# EAGLE design youuuuuuh (EAGLE 9.6.2)
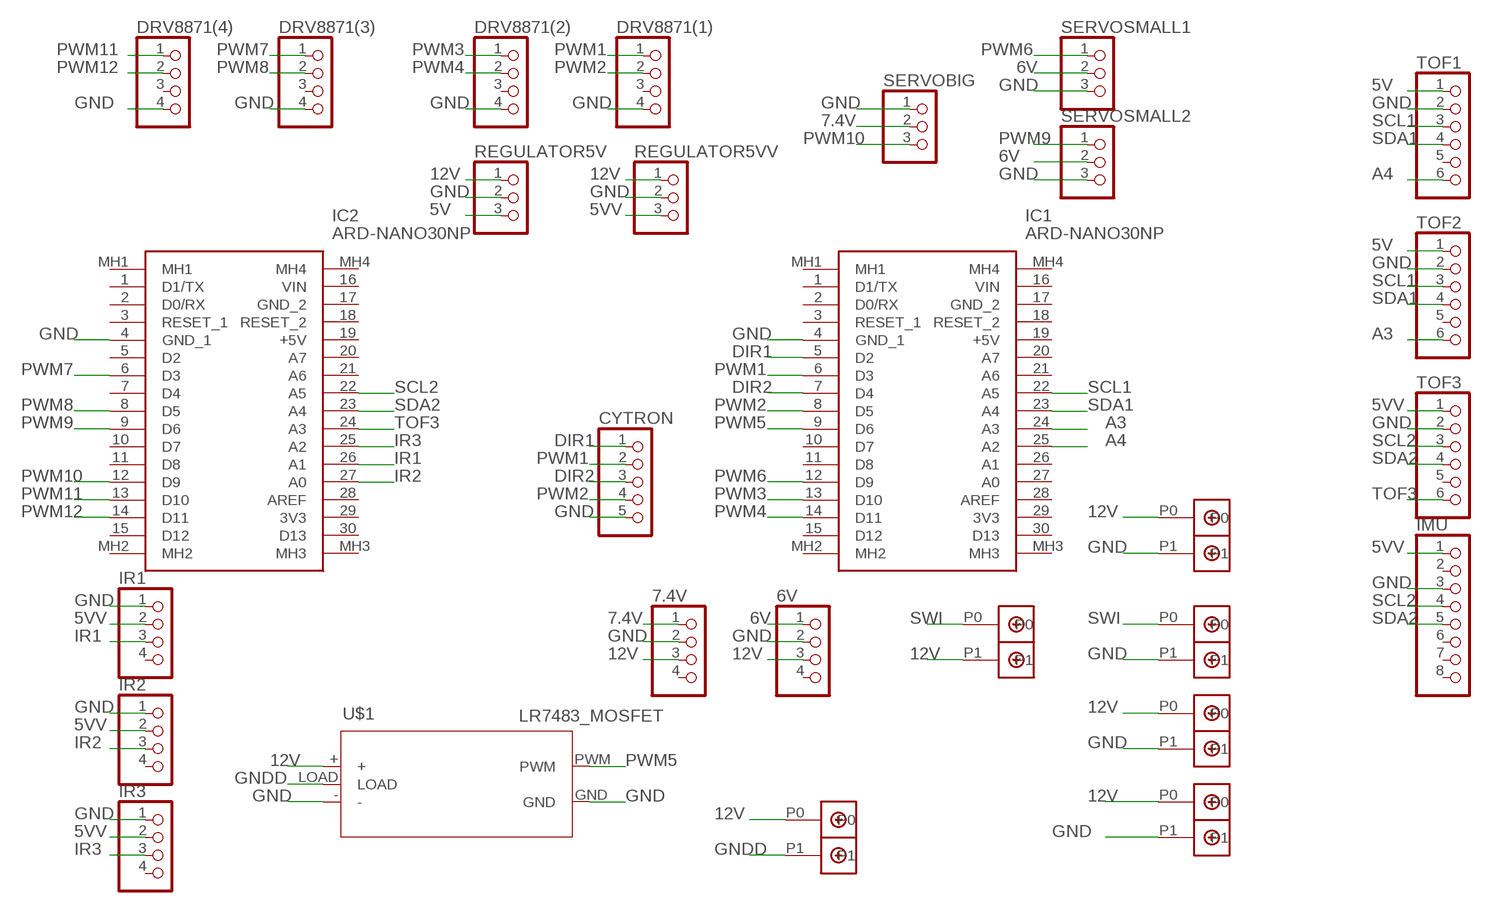
[diagram p0: schematic, sheet 1]

## Parts
6V  PINHD-1X4  [1X04]
7.4V  PINHD-1X4  [1X04]
BATERY  DBCONN-1X2  [DBCONN-1X2]
BUCKSERVO  DBCONN-1X2  [DBCONN-1X2]
CYTRON  PINHD-1X5  [1X05]
CYTRONPOWER  DBCONN-1X2  [DBCONN-1X2]
DRV8871(1)  PINHD-1X4  [1X04]
DRV8871(2)  PINHD-1X4  [1X04]
DRV8871(3)  PINHD-1X4  [1X04]
DRV8871(4)  PINHD-1X4  [1X04]
IC1  ARD-NANO30NP  [ARDNANO30NP]
IC2  ARD-NANO30NP  [ARDNANO30NP]
IMU  PINHD-1X8  [1X08]
IR1  PINHD-1X4  [1X04]
IR2  PINHD-1X4  [1X04]
IR3  PINHD-1X4  [1X04]
LEDS1  DBCONN-1X2  [DBCONN-1X2]
LEDS2  DBCONN-1X2  [DBCONN-1X2]
LEDS3  DBCONN-1X2  [DBCONN-1X2]
REGULATOR5V  PINHD-1X3  [1X03]
REGULATOR5VV  PINHD-1X3  [1X03]
SERVOBIG  PINHD-1X3  [1X03]
SERVOSMALL1  PINHD-1X3  [1X03]
SERVOSMALL2  PINHD-1X3  [1X03]
TOF1  PINHD-1X6  [1X06]
TOF2  PINHD-1X6  [1X06]
TOF3  PINHD-1X6  [1X06]
U$1  LR7483_MOSFET  [LR7483_MOSFET]

## Nets
5V: REGULATOR5V.3 TOF1.1 TOF2.1
5VV: IMU.1 IR1.2 IR2.2 IR3.2 REGULATOR5VV.3 TOF3.1
6V: 6V.1 SERVOSMALL1.2 SERVOSMALL2.2
7.4V: 7.4V.1 SERVOBIG.2
12V: 6V.3 7.4V.3 BUCKSERVO.P0 CYTRONPOWER.P0 LEDS1.P1 LEDS2.P0 LEDS3.P0 REGULATOR5V.1 REGULATOR5VV.1 U$1.+
A3: IC1.24(A3) TOF2.6
A4: IC1.25(A2) TOF1.6
DIR1: CYTRON.1 IC1.5(D2)
DIR2: CYTRON.3 IC1.7(D4)
GND: 6V.2 7.4V.2 BATERY.P1 BUCKSERVO.P1 CYTRON.5 CYTRONPOWER.P1 DRV8871(1).4 DRV8871(2).4 DRV8871(3).4 DRV8871(4).4 IC1.4(GND_1) IC2.4(GND_1) IMU.3 IR1.1 IR2.1 IR3.1 LEDS2.P1 REGULATOR5V.2 REGULATOR5VV.2 SERVOBIG.1 SERVOSMALL1.3 SERVOSMALL2.3 TOF1.2 TOF2.2 TOF3.2 U$1.- U$1.GND
GNDD: LEDS3.P1 U$1.LOAD
IR1: IC2.26(A1) IR1.3
IR2: IC2.27(A0) IR2.3
IR3: IC2.25(A2) IR3.3
PWM1: CYTRON.2 DRV8871(1).1 IC1.6(D3)
PWM2: CYTRON.4 DRV8871(1).2 IC1.8(D5)
PWM3: DRV8871(2).1 IC1.13(D10)
PWM4: DRV8871(2).2 IC1.14(D11)
PWM5: IC1.9(D6) U$1.PWM
PWM6: IC1.12(D9) SERVOSMALL1.1
PWM7: DRV8871(3).1 IC2.6(D3)
PWM8: DRV8871(3).2 IC2.8(D5)
PWM9: IC2.9(D6) SERVOSMALL2.1
PWM10: IC2.12(D9) SERVOBIG.3
PWM11: DRV8871(4).1 IC2.13(D10)
PWM12: DRV8871(4).2 IC2.14(D11)
SCL1: IC1.22(A5) TOF1.3 TOF2.3
SCL2: IC2.22(A5) IMU.4 TOF3.3
SDA1: IC1.23(A4) TOF1.4 TOF2.4
SDA2: IC2.23(A4) IMU.5 TOF3.4
SWI: BATERY.P0 LEDS1.P0
TOF3: IC2.24(A3) TOF3.6
Unconnected: 6V.4 7.4V.4 DRV8871(1).3 DRV8871(2).3 DRV8871(3).3 DRV8871(4).3 IC1.1(D1/TX) IC1.2(D0/RX) IC1.3(RESET_1) IC1.10(D7) IC1.11(D8) IC1.15(D12) IC1.16(VIN) IC1.17(GND_2) IC1.18(RESET_2) IC1.19(+5V) IC1.20(A7) IC1.21(A6) IC1.26(A1) IC1.27(A0) IC1.28(AREF) IC1.29(3V3) IC1.30(D13) IC1.MH1 IC1.MH2 IC1.MH3 IC1.MH4 IC2.1(D1/TX) IC2.2(D0/RX) IC2.3(RESET_1) IC2.5(D2) IC2.7(D4) IC2.10(D7) IC2.11(D8) IC2.15(D12) IC2.16(VIN) IC2.17(GND_2) IC2.18(RESET_2) IC2.19(+5V) IC2.20(A7) IC2.21(A6) IC2.28(AREF) IC2.29(3V3) IC2.30(D13) IC2.MH1 IC2.MH2 IC2.MH3 IC2.MH4 IMU.2 IMU.6 IMU.7 IMU.8 IR1.4 IR2.4 IR3.4 TOF1.5 TOF2.5 TOF3.5

## Library data of the parts
6V 7.4V DRV8871(1) DRV8871(2) DRV8871(3) DRV8871(4) = pinhead:PINHD-1X4: PIN HEADER
BATERY BUCKSERVO CYTRONPOWER LEDS1-LEDS3 = Terminal Block Connector:DBCONN-1X2
CYTRON = pinhead:PINHD-1X5: PIN HEADER
IC1 IC2 = ARD-NANO30NP:ARD-NANO30NP: Development Boards & Kits - AVR Arduino Nano 3.1 W/ATMEGA328 NO-PIN Source: Datasheet <http://www.mouser.com/datasheet/2/595/Arduino_Nano3_0-220057.pdf>; DESCRIPTION: Development Boards & Kits - AVR Arduino Nano 3.1 W/ATMEGA328 NO-PIN; HEIGHT: 5mm; MANUFACTURER_NAME: Gravitech; MANUFACTURER_PART_NUMBER: ARD-NANO30NP; MOUSER_PART_NUMBER: 992-ARD-NANO30NP; MOUSER_PRICE-STOCK: https://www.mouser.co.uk/ProductDetail/Gravitech/ARD-NANO30NP?qs=Vxac6xGyzPlh7in3DWNTbQ%3D%3D
IMU = pinhead:PINHD-1X8: PIN HEADER
IR1-IR3 = pinhead by eyad and omar:PINHD-1X4: PIN HEADER
REGULATOR5V SERVOBIG SERVOSMALL1 SERVOSMALL2 = pinhead:PINHD-1X3: PIN HEADER
REGULATOR5VV = pinhead by eyad and omar:PINHD-1X3: PIN HEADER
TOF1-TOF3 = pinhead:PINHD-1X6: PIN HEADER
U$1 = LR7483_MOSFET_Module:LR7483_MOSFET

## Board
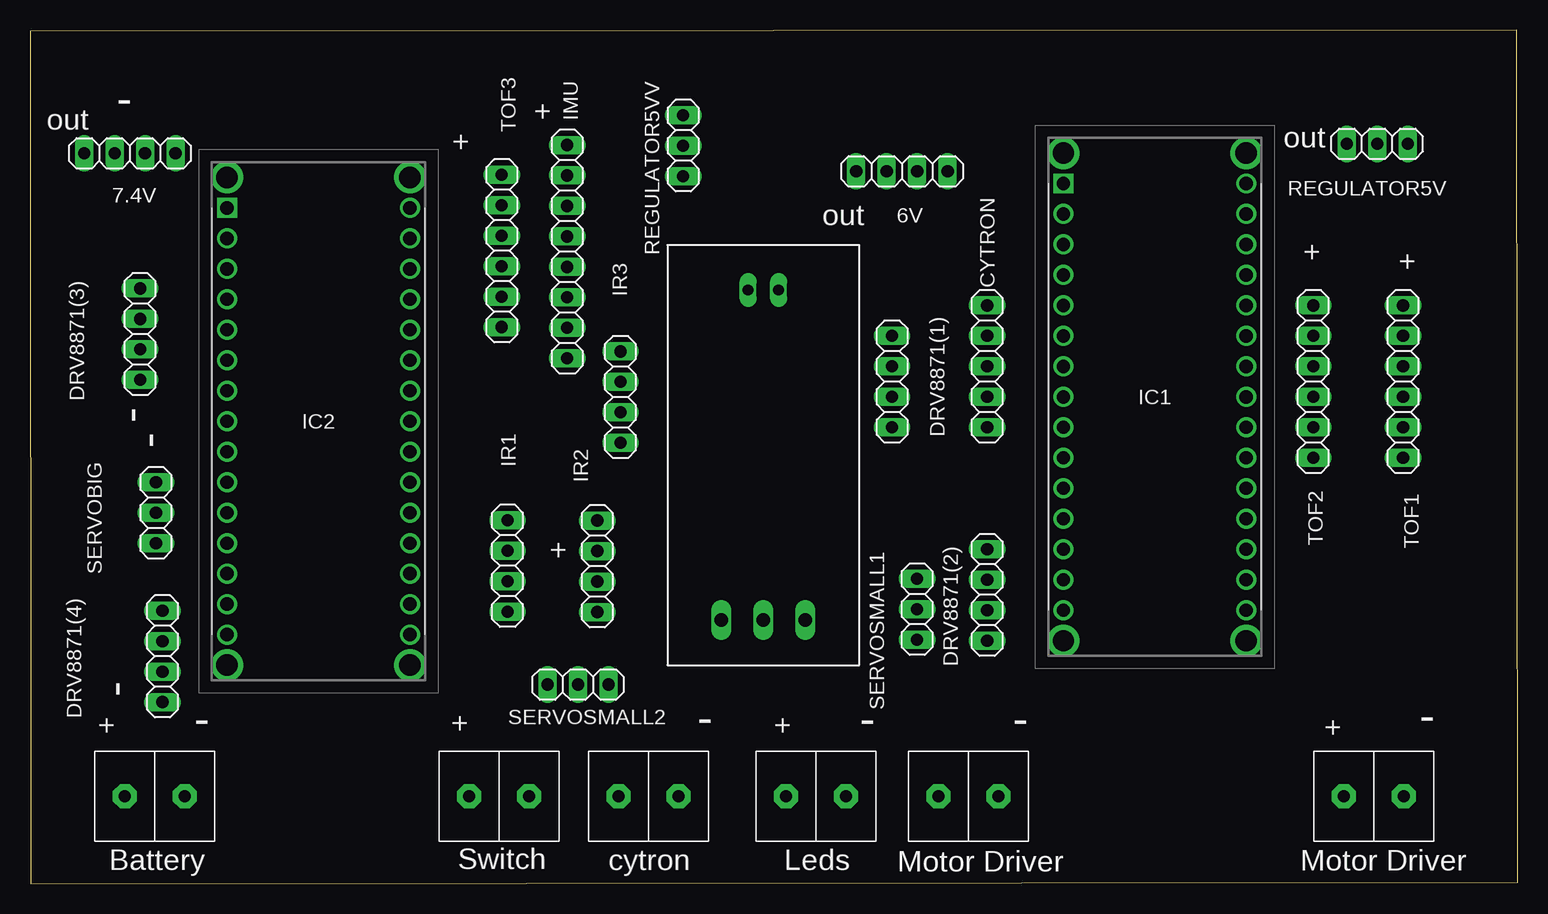
[diagram p1: board, top side]
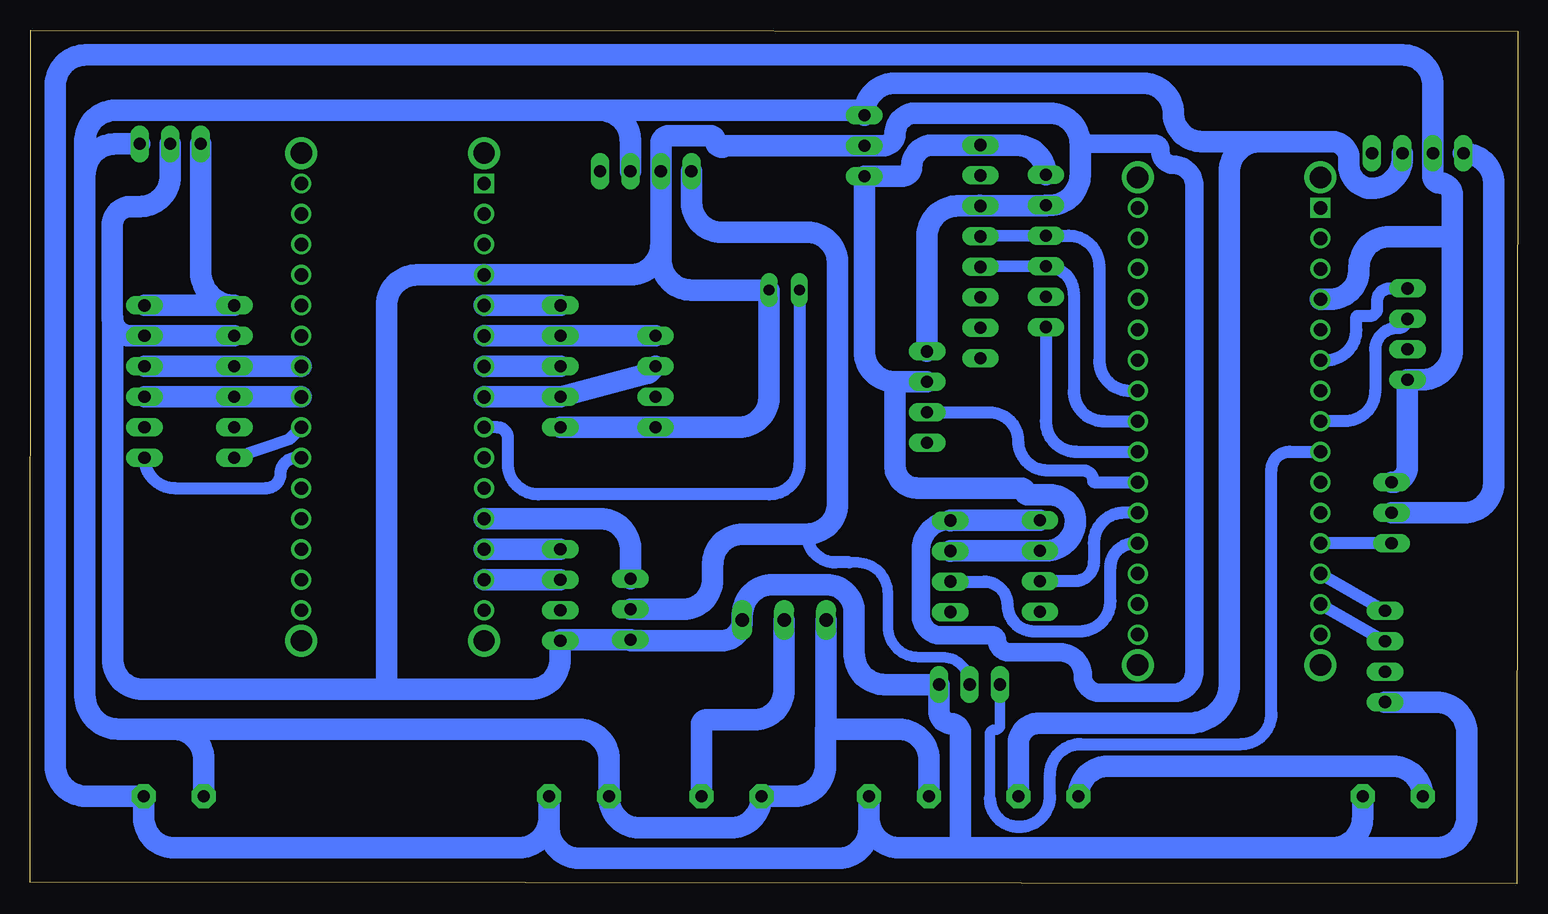
[diagram p2: board, bottom side, seen from below]

Size 124 x 71.13 mm. Coordinates in mm from the lower left corner, seen from the top.
Outline: 123.96,71.13 0,71.02 0.05,0 124,0.11 123.96,71.13
Copper layers (1*16): Top 0.035mm / dielectric 1.5mm / Bottom 0.035mm
Design rules "default": minimum track width 6mil, minimum drill 0.35mm, track to track 6mil, track to pad 6mil, pad to pad 6mil, via to via 6mil, smd to smd 6mil, copper to edge 40mil, drill to drill 6mil, minimum pad ring 10mil, minimum via ring 8mil, stop-mask expansion 4mil, vias tented up to drill 0mil, thermal gap 10mil

### Footprints (pad centres in the part's own frame; a part is rotated, then mirrored left to right if it is on the bottom)
1X04 = drill 1.016 long: 1 -3.81,0; 2 -1.27,0; 3 1.27,0; 4 3.81,0
DBCONN-1X2 = drill 1 pad 2 octagon: P0 -2.54,0; P1 2.46,0
1X05 = drill 1.016 long: 1 -5.08,0; 2 -2.54,0; 3 0,0; 4 2.54,0; 5 5.08,0
ARDNANO30NP = drill 1.11 pad 1.665 square: 1 0,0 | drill 1.11 pad 1.665: 2 0,-2.54; 3 0,-5.08; 4 0,-7.62; 5 0,-10.16; 6 0,-12.7; 7 0,-15.24; 8 0,-17.78; 9 0,-20.32; 10 0,-22.86; 11 0,-25.4; 12 0,-27.94; 13 0,-30.48; 14 0,-33.02; 15 0,-35.56; 16 15.24,0; 17 15.24,-2.54; 18 15.24,-5.08; 19 15.24,-7.62; 20 15.24,-10.16; 21 15.24,-12.7; 22 15.24,-15.24; 23 15.24,-17.78; 24 15.24,-20.32; 25 15.24,-22.86; 26 15.24,-25.4; 27 15.24,-27.94; 28 15.24,-30.48; 29 15.24,-33.02; 30 15.24,-35.56 | drill 1.778 pad 2.667: MH1 0,2.54; MH2 0,-38.1; MH3 15.24,-38.1; MH4 15.24,2.54
1X08 = drill 1.016 long: 1 -8.89,0; 2 -6.35,0; 3 -3.81,0; 4 -1.27,0; 5 1.27,0; 6 3.81,0; 7 6.35,0; 8 8.89,0
1X03 = drill 1.016 long: 1 -2.54,0; 2 0,0; 3 2.54,0
1X06 = drill 1.016 long: 1 -6.35,0; 2 -3.81,0; 3 -1.27,0; 4 1.27,0; 5 3.81,0; 6 6.35,0
LR7483_MOSFET = drill 1.1 long: + 3.75,11.5; - 3.75,4.5; LOAD 3.75,8 | drill 0.9 pad 1.422 long: GND 31.25,6.73; PWM 31.25,9.27

### Placement (x,y rotation side)
6V  72.68,59.36 0 top
7.4V  8.32,60.85 0 top
BATERY  10.45,7.29 0 top
BUCKSERVO  112.05,7.29 0 top
CYTRON  79.78,43.1 270 top
CYTRONPOWER  51.6,7.29 0 top
DRV8871(1)  71.86,41.83 270 top
DRV8871(2)  79.8,24.05 270 top
DRV8871(3)  9.18,45.79 270 top
DRV8871(4)  11.05,18.94 270 top
IC1  86.15,58.34 0 top
IC2  16.43,56.31 0 top
IMU  44.78,52.66 270 top
IR1  39.81,26.47 270 top
IR2  47.28,26.44 270 top
IR3  49.22,40.54 270 top
LEDS1  39.16,7.29 0 top
LEDS2  78.27,7.29 0 top
LEDS3  65.57,7.29 0 top
REGULATOR5V  112.31,61.64 180 top
REGULATOR5VV  54.45,61.5 270 top
SERVOBIG  10.5,30.9 270 top
SERVOSMALL1  73.95,22.86 270 top
SERVOSMALL2  45.68,16.59 0 top
TOF1  114.46,41.83 270 top
TOF2  106.97,41.83 270 top
TOF3  39.32,52.73 270 top
U$1  69.13,18.21 90 top

### Tracks (layer width: path | path; a pad name or v marks a point on that pad's centre or on a via)
5V
  Bottom 1.778: TOF1.1 TOF2.1 arc90 109.77,50.98 REGULATOR5V.3
5VV
  Bottom 1.778: TOF3.1 arc-90 41.8,61.55 IMU.1 48.72,61.55 arc-90 50.51,59.77 arc90 51.32,58.96 REGULATOR5VV.3 54.45,44.35 arc-90 51.91,41.81 | IR1.2 47.25,27.74 arc-90 IR2.2 | IR3.2 51.91,41.81 | IR1.2 39.56,27.74 | 51.91,41.81 51.91,34.86 arc-90 50.01,32.96 41.4,32.96 arc90 41.04,32.6 arc-90 40.85,32.42 39.03,32.42 arc90 36.85,30.23 36.85,30.23 arc90 39.33,27.74 IR1.2
6V
  Bottom 0.889: SERVOSMALL2.2 arc-90 47.97,18.88 49.96,18.88 arc90 52.5,21.42 52.5,24.22 arc-90 55.04,26.76 55.69,26.76
  Bottom 1.016: 55.69,26.76 56.85,26.76 arc90 59.22,29.13
  Bottom 1.778: 6V.1 68.87,56.82 arc-90 66.33,54.28 59.22,54.28 arc90 56.68,51.74 56.68,31.67 arc90 59.22,29.13 64.56,29.13 arc-90 67.1,26.59 67.1,25.32 arc90 69.56,22.86 SERVOSMALL1.2
7.4V
  Bottom 1.778: 7.4V.1 7.4V.1 arc90 1.97,58.31 1.97,33.44 arc90 4.51,30.9 SERVOBIG.2
12V
  Bottom 1.778: 112.05,12.88 116.63,12.88 arc90 119.42,15.67 119.42,59.1 | 112.05,12.88 arc90 109.51,10.34 BUCKSERVO.P0 | 112.05,12.88 78.27,12.88 arc90 75.73,10.34 LEDS2.P0 75.73,7.18 arc-90 73.19,4.64 65.57,4.64 arc-90 63.03,7.18 LEDS3.P0 60.24,7.29 arc-90 57.7,9.83 57.7,12.88 | CYTRONPOWER.P0 49.06,10.34 arc-90 51.6,12.88 57.7,12.88 | U$1.+ 57.63,12.95 arc90 57.7,12.88 | 6V.3 73.95,61.9 arc-90 76.49,64.44 | 119.42,59.1 arc90 116.88,61.64 REGULATOR5V.1 | 119.42,59.1 119.42,61.9 arc90 116.88,64.44 76.49,64.44 | 7.4V.3 9.59,60.47 arc90 12.13,57.93 arc90 14.06,59.86 14.06,60.42 arc-90 15.48,61.84 21.49,61.84 | 76.49,64.44 54.85,64.44 arc90 REGULATOR5VV.1 54.45,64.17 arc90 51.91,66.71 31.22,66.71 arc90 28.68,64.17 arc-90 26.35,61.84 21.49,61.84 | LEDS1.P1 41.62,11.63 arc90 39.88,13.37 27.37,13.37 arc-90 24.03,16.71 24.03,59.3 arc90 21.49,61.84
A3
  Bottom 1.016: TOF2.6 102.32,37.08 IC1.24
A4
  Bottom 1.016: TOF1.6 arc-90 111.94,32.96 104.32,32.96 arc-90 103.12,34.16 arc90 101.8,35.48 IC1.25
DIR1
  Bottom 1.778: CYTRON.1 IC1.5
DIR2
  Bottom 1.778: CYTRON.3 IC1.7
GND
  Bottom 1.524: IR2.1 arc-90 49.74,27.8 49.74,22.4 arc-90 48.02,20.68 43.78,20.68 arc90 43.41,20.31 arc-90 42.37,19.27 38.16,19.27 arc90 36.24,17.35 arc-90 34.78,15.89 28.73,15.89 arc-90 26.94,17.69 26.94,58.15 arc-90 28.69,59.9 arc90 29.76,60.98 29.76,61.1 arc-90 30.33,61.67 36.46,61.67
  Bottom 1.778: CYTRON.5 DRV8871(1).4 | TOF2.2 TOF1.2 115.61,45.64 arc90 117.13,47.17 | DRV8871(1).4 71.61,38.02 | BATERY.P1 12.91,5.51 arc90 15.45,2.97 | 15.45,2.97 46.43,2.97 | 94.27,16.18 82.34,16.18 arc-90 79.8,18.72 DRV8871(2).4 arc90 79.72,20.32 SERVOSMALL1.3 arc-90 73.87,20.24 66.35,20.24 arc-90 U$1.- 64.63,22.38 arc90 62.09,24.92 57.61,24.92 arc90 55.3,22.61 55.3,19.13 arc-90 52.76,16.59 SERVOSMALL2.3 48.22,14.32 arc-90 47.22,13.33 arc90 46.43,12.53 46.43,2.97 | 94.27,16.18 114.59,16.18 arc90 117.12,18.7 117.12,47.15 arc-90 117.13,47.17 | 94.27,16.18 94.27,48.18 arc90 91.73,50.72 IC1.4 73.95,50.72 arc-90 71.41,53.26 6V.2 | 46.43,2.97 51.52,2.97 arc90 54.06,5.51 CYTRONPOWER.P1 54.06,4.65 arc90 56.6,2.11 78.19,2.11 arc90 80.73,4.65 LEDS2.P1 80.73,5.51 arc90 83.27,2.97 111.97,2.97 arc90 114.51,5.51 BUCKSERVO.P1 119.35,7.29 arc90 121.89,9.83 121.89,66.52 arc90 119.35,69.06 9.59,69.06 arc90 7.05,66.52 7.4V.2 7.05,58.96 arc-90 6.48,58.38 arc90 5.44,57.34 5.44,53.92 | 6V.2 71.41,52 arc-90 68.87,49.46 U$1.GND 62.4,40.56 arc90 64.94,38.02 DRV8871(1).4 | IMU.3 39.39,56.47 arc-90 TOF3.2 39,56.54 arc-90 36.46,59.08 36.46,61.67 arc-90 39,64.21 50.15,64.21 arc-90 51.9,62.46 arc90 52.86,61.5 REGULATOR5VV.2 | REGULATOR5VV.2 54.55,61.5 | 44.83,56.51 arc90 IMU.3 | 6V.2 71.41,59.62 | IR1.1 47.25,30.28 arc-90 IR2.1 | IMU.3 46.68,56.47 arc-90 49.22,53.93 IR3.1 | SERVOBIG.1 arc-90 9.18,34.76 DRV8871(3).4 7.98,41.98 arc-90 5.44,44.52 5.44,53.92 | IC2.4 15.62,48.69 arc-90 13.22,51.09 13.22,51.38 arc90 10.68,53.92 5.44,53.92 | REGULATOR5VV.2 66.12,61.5 arc-90 66.24,61.38 66.36,61.38 arc90 66.86,61.88 arc-90 67.29,62.32 70.72,62.32 arc-90 71.41,61.62 6V.2
  Bottom 1.778: DRV8871(4).4 6.78,15.13 arc90 4.24,12.59 4.24,5.51 arc90 6.78,2.97 15.45,2.97 | REGULATOR5V.2 112.31,58.96 arc90 114.85,56.42 115.62,56.42 arc-90 117.13,54.9 117.13,47.17
GNDD
  Bottom 1.778: LEDS3.P1 68.03,13.21 arc90 67.6,13.64 63.67,13.64 arc-90 61.13,16.18 U$1.LOAD
IR1
  Bottom 1.016: IC2.26 32.79,30.91 arc-90 35.33,28.37 35.33,26.78 arc90 36.91,25.2 IR1.3
IR2
  Bottom 1.016: IR2.3 44.47,25.17 arc90 42.52,23.22 arc-90 40.33,21.03 36.47,21.03 arc-90 33.93,23.57 33.93,26.36 arc90 31.92,28.37 IC2.27
IR3
  Bottom 1.016: IR3.3 44.02,39.27 arc90 41.63,36.88 arc-90 39.19,34.44 36.24,34.44 arc90 35.38,33.58 arc-90 35.25,33.45 IC2.25
PWM1
  Bottom 1.778: IC1.6 CYTRON.2 DRV8871(1).1
PWM2
  Bottom 1.778: IC1.8 CYTRON.4 72.42,42.54 DRV8871(1).2
PWM3
  Bottom 1.778: DRV8871(2).1 IC1.13
PWM4
  Bottom 1.778: DRV8871(2).2 IC1.14
PWM5
  Bottom 1.016: U$1.PWM 59.86,34.98 arc90 62.4,32.44 81.63,32.44 arc90 84.17,34.98 84.17,37.13 arc-90 85.05,38.02 IC1.9
PWM6
  Bottom 1.778: SERVOSMALL1.1 73.95,27.86 arc-90 76.49,30.4 IC1.12
PWM7
  Bottom 1.016: IC2.6 15.97,43.61 arc-90 13.43,46.15 13.43,47.19 arc90 13.31,47.31 12.33,47.31 arc-90 11.7,47.94 11.7,48.55 arc90 10.66,49.6 DRV8871(3).1
PWM8
  Bottom 1.016: DRV8871(3).2 arc90 9.94,46.29 10.06,46.29 arc-90 11.87,44.48 11.87,41.07 arc90 14.41,38.53 IC2.8
PWM9
  Bottom 0.889: SERVOSMALL2.1 43.14,13.25 arc90 43.57,12.82 arc-90 43.99,12.39 43.99,7.11
  Bottom 1.016: 43.99,7.11 arc-90 41.62,4.74 41.51,4.74 arc-90 38.97,7.28 38.97,9.08 arc90 36.43,11.62 23.05,11.62 arc-90 20.51,14.16 20.51,34.47 arc90 19,35.99 IC2.9
PWM10
  Bottom 1.016: SERVOBIG.3 IC2.12
PWM11
  Bottom 1.016: DRV8871(4).1 IC2.13
PWM12
  Bottom 1.016: DRV8871(4).2 IC2.14
SCL1
  Bottom 1.778: IC1.22 TOF2.3 TOF1.3
SCL2
  Bottom 1.016: IMU.4 TOF3.3 37.41,54 arc90 34.87,51.46 34.87,43.61 arc-90 32.33,41.07 IC2.22
SDA1
  Bottom 1.778: IC1.23 TOF2.4 TOF1.4
SDA2
  Bottom 1.016: IMU.5 TOF3.4 arc90 37,49.13 37,41.07 arc-90 34.46,38.53 IC2.23
SWI
  Bottom 1.778: BATERY.P0 arc-90 10.42,9.79 34.11,9.79 arc-90 LEDS1.P0
TOF3
  Bottom 1.016: TOF3.6 39.32,38.53 arc-90 36.78,35.99 IC2.24

### Text on the board
tNames: - | + | out | TOF3 | + | out | out | + | + | - | - | IR1 | + | - | - | + | - | - | - | - | + | + | + | Battery | Switch | cytron | Leds | Motor Driver | Motor Driver